# Altium schematic sheet Battery_BMS.SchDoc: Battery & BMS
size A3; DocumentNumber: 2; SheetNumber: 2; SheetTotal: 19
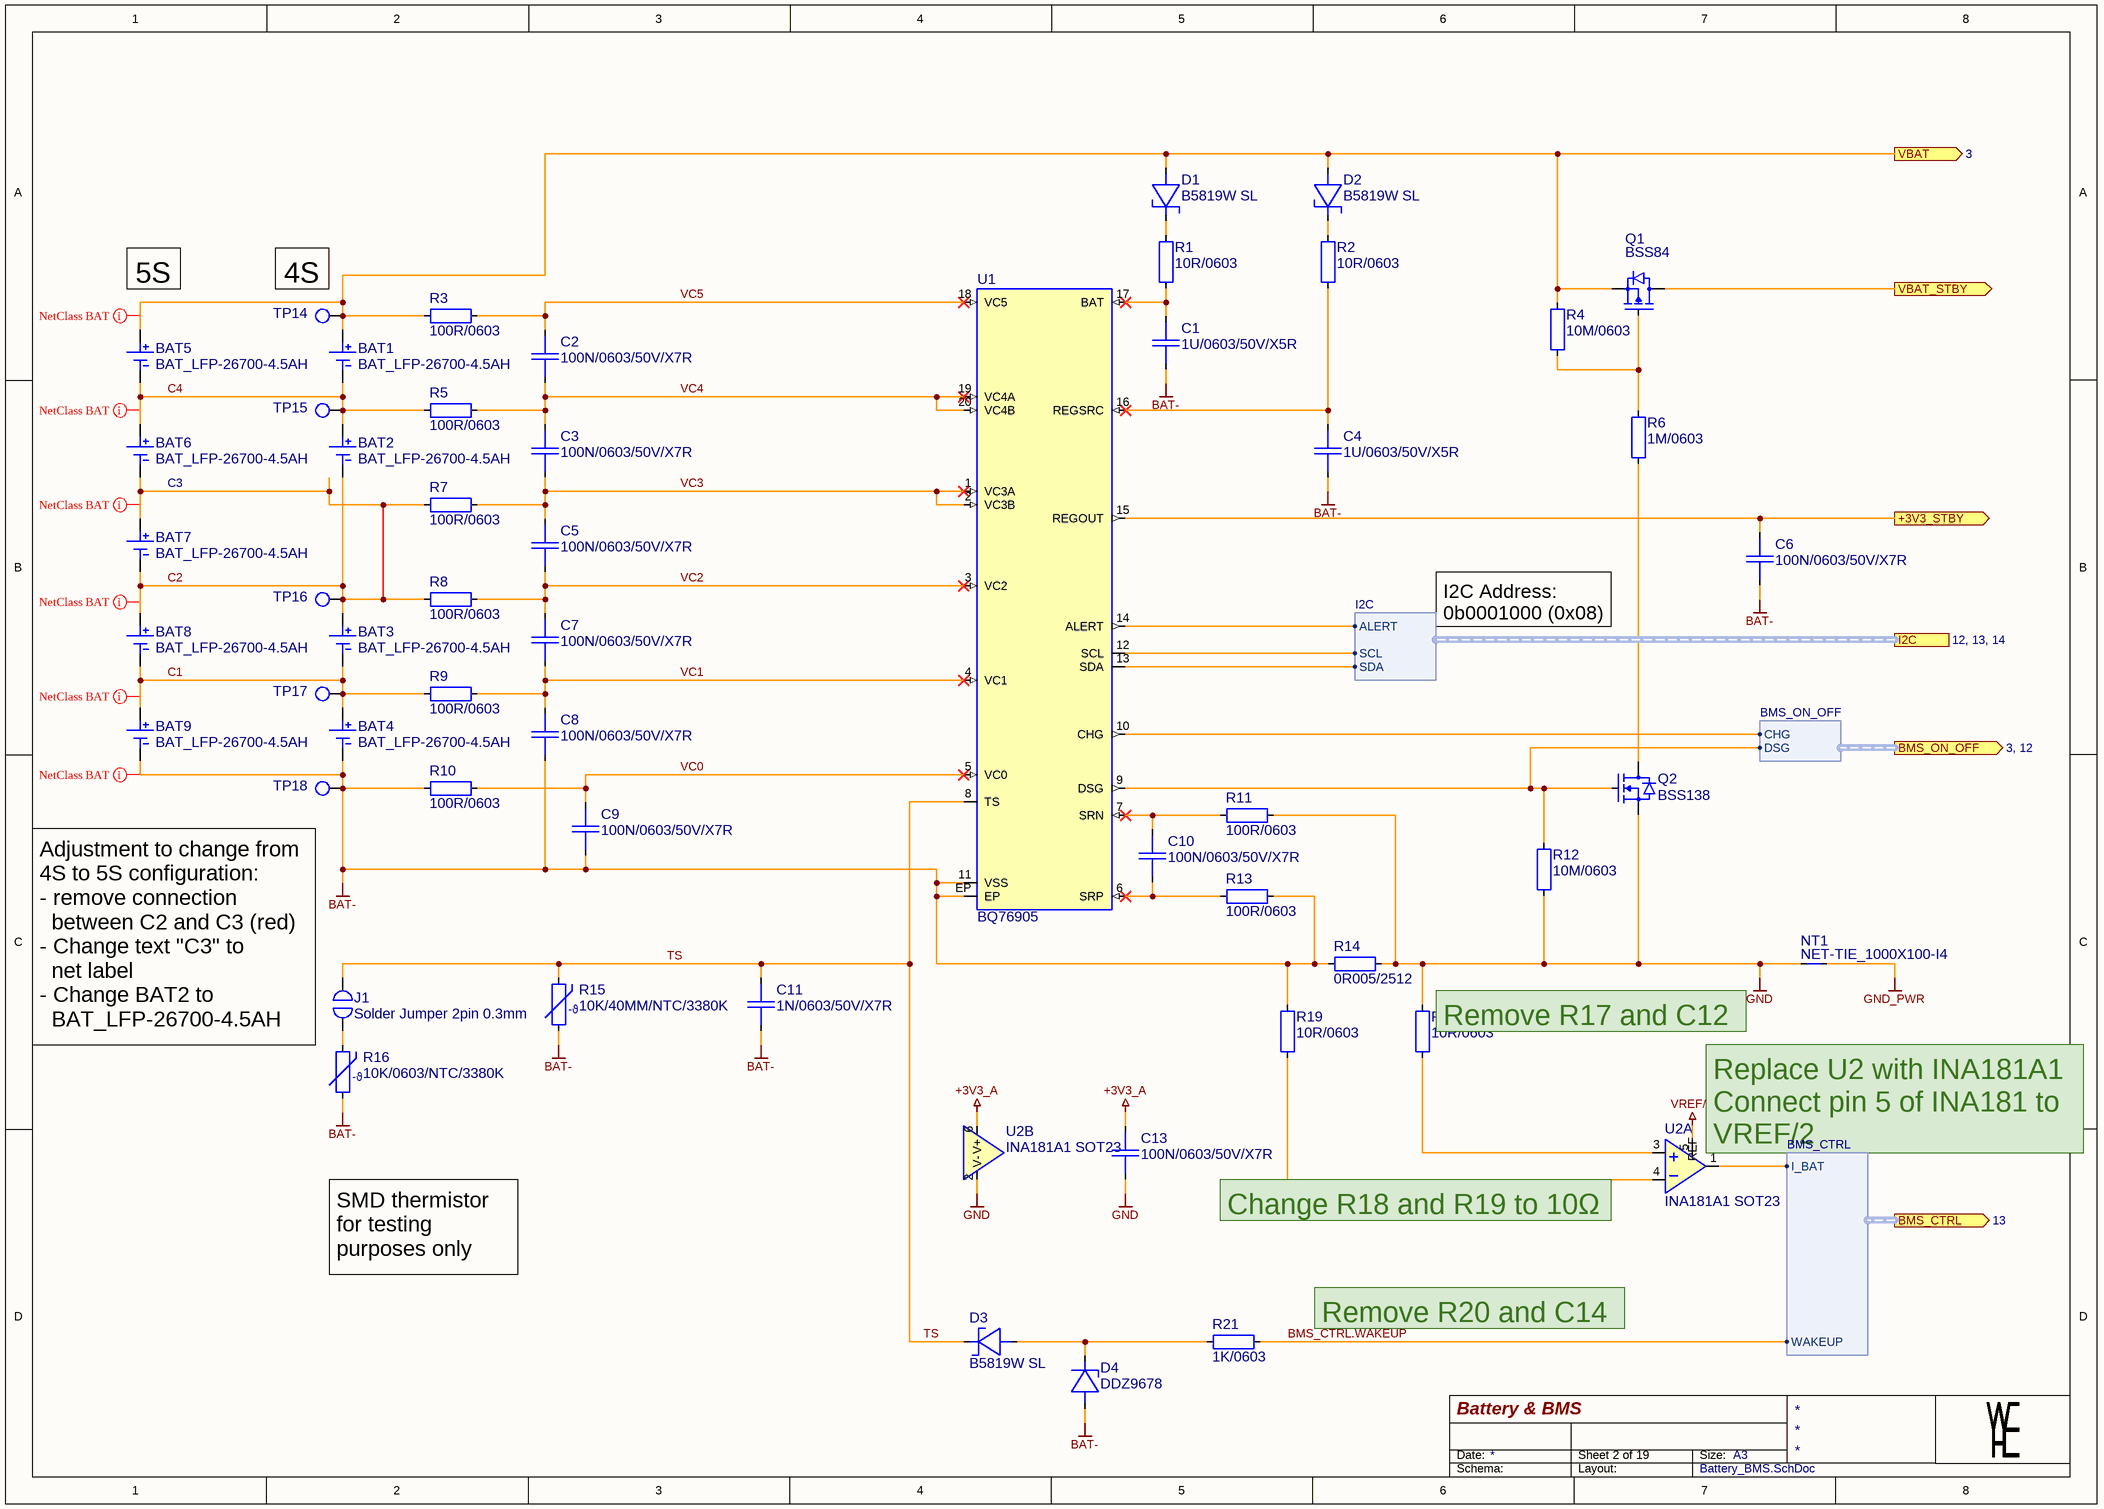
[diagram p0: Battery_BMS.SchDoc]

## Parts
BAT1  BAT_LFP-26700-4.5AH  [BAT-26700-PS]
BAT2  BAT_LFP-26700-4.5AH  [BAT-26700-PS]
BAT3  BAT_LFP-26700-4.5AH  [BAT-26700-PS]
BAT4  BAT_LFP-26700-4.5AH  [BAT-26700-PS]
BAT5  BAT_LFP-26700-4.5AH  [BAT-26700-PS]  (graphical)
BAT6  BAT_LFP-26700-4.5AH  [BAT-26700-PS]  (graphical)
BAT7  BAT_LFP-26700-4.5AH  [BAT-26700-PS]  (graphical)
BAT8  BAT_LFP-26700-4.5AH  [BAT-26700-PS]  (graphical)
BAT9  BAT_LFP-26700-4.5AH  [BAT-26700-PS]  (graphical)
C1  1U/0603/50V/X5R  [CAP0603_X7R]
C2  100N/0603/50V/X7R  [CAP0603_X7R]
C3  100N/0603/50V/X7R  [CAP0603_X7R]
C4  1U/0603/50V/X5R  [CAP0603_X7R]
C5  100N/0603/50V/X7R  [CAP0603_X7R]
C6  100N/0603/50V/X7R  [CAP0603_X7R]
C7  100N/0603/50V/X7R  [CAP0603_X7R]
C8  100N/0603/50V/X7R  [CAP0603_X7R]
C9  100N/0603/50V/X7R  [CAP0603_X7R]
C10  100N/0603/50V/X7R  [CAP0603_X7R]
C11  1N/0603/50V/X7R  [CAP0603_X7R]
C13  100N/0603/50V/X7R  [CAP0603_X7R]
D1  B5819W SL  [SOD3718X125]
D2  B5819W SL  [SOD3718X125]
D3  B5819W SL  [SOD3718X125]
D4  DDZ9678  [SOD3718X125]
J1  Solder Jumper 2pin 0.3mm  [Solder_Jumper_2pin_0.3mm]
NT1  NET-TIE_1000X100-I4  [NET-TIE_1000X100]  (net tie, no BOM)
Q1  BSS84  [SOT2395P280X125-3-SE]
Q2  BSS138  [SOT2395P280X125-3-SE]
R1  10R/0603  [R0603-0.40-WW]
R2  10R/0603  [R0603-0.40-WW]
R3  100R/0603  [R0603-0.40-WW]
R4  10M/0603  [R0603-0.40-WW]
R5  100R/0603  [R0603-0.40-WW]
R6  1M/0603  [R0603-0.40-WW]
R7  100R/0603  [R0603-0.40-WW]
R8  100R/0603  [R0603-0.40-WW]
R9  100R/0603  [R0603-0.40-WW]
R10  100R/0603  [R0603-0.40-WW]
R11  100R/0603  [R0603-0.40-WW]
R12  10M/0603  [R0603-0.40-WW]
R13  100R/0603  [R0603-0.40-WW]
R14  0R005/2512  [R2512-0.65-WW]
R15  10K/40MM/NTC/3380K  [RESD200W25D200H4000]
R16  10K/0603/NTC/3380K  [R0603-0.40-WW]
R18  10R/0603  [R0603-0.40-WW]
R19  10R/0603  [R0603-0.40-WW]
R21  1K/0603  [R0603-0.40-WW]
TP14  TP_THD_1.5/0.8  [TP_THD_1.5/0.8]  (value not drawn)  (no BOM)
TP15  TP_THD_1.5/0.8  [TP_THD_1.5/0.8]  (value not drawn)  (no BOM)
TP16  TP_THD_1.5/0.8  [TP_THD_1.5/0.8]  (value not drawn)  (no BOM)
TP17  TP_THD_1.5/0.8  [TP_THD_1.5/0.8]  (value not drawn)  (no BOM)
TP18  TP_THD_1.5/0.8  [TP_THD_1.5/0.8]  (value not drawn)  (no BOM)
U1  BQ76905  [QFN050P350X350X100-20-EP200X200]
U2  INA181A1 SOT23  [SOT2395P280X125-6-SE]  (parts A,B of 2)

## Ports
+3V3_STBY (out), BMS_CTRL (out, harness BMS_CTRL, see 13), BMS_ON_OFF (out, harness BMS_ON_OFF, see 3, 12), I2C (harness I2C, see 12, 13, 14), VBAT (out, see 3), VBAT_STBY (out)

## Harnesses
I2C: ALERT, SCL, SDA
BMS_ON_OFF: CHG, DSG
BMS_CTRL: I_BAT, WAKEUP

## Nets
+3V3_A: C13.1 U2.6(V+)
BAT-: BAT4.2(-) BAT9.2(-) C1.2 C4.2 C6.2 C8.2 C9.2 C11.2 D4.2(A) R10.1 R13.2 R14.1 R15.2 R16.2 R19.1 TP18.1 U1.11(VSS) U1.EP
GND: C13.2 NT1.1 Q2.2(SOURCE) R11.2 R12.2 R14.2 R18.1 U2.2(V-)
GND_PWR: NT1.2
VREF/2: U2.5(REF)
+3V3_STBY: C6.1 U1.15(REGOUT) ; port +3V3_STBY
BMS_CTRL.WAKEUP: R21.2 ; port BMS_CTRL.WAKEUP
C1: BAT3.2(-) BAT4.1(+) BAT8.2(-) BAT9.1(+) R9.1 TP17.1
C2: BAT2.2(-) BAT3.1(+) BAT6.2(-) BAT7.1(+) BAT7.2(-) BAT8.1(+) R7.1 R8.1 TP16.1
C4: BAT1.2(-) BAT2.1(+) BAT5.2(-) BAT6.1(+) R5.1 TP15.1
TS: C11.1 D3.1(C) J1.1 R15.1 U1.8(TS)
VBAT: BAT1.1(+) BAT5.1(+) D1.2(A) D2.2(A) Q1.2(SOURCE) R3.1 R4.1 TP14.1 ; port VBAT
VBAT_STBY: Q1.3(DRAIN) ; port VBAT_STBY
VC0: C9.1 R10.2 U1.5(VC0)
VC1: C7.2 C8.1 R9.2 U1.4(VC1)
VC2: C5.2 C7.1 R8.2 U1.3(VC2)
VC3: C3.2 C5.1 R7.2 U1.1(VC3A) U1.2(VC3B)
VC4: C2.2 C3.1 R5.2 U1.19(VC4A) U1.20(VC4B)
VC5: C2.1 R3.2 U1.18(VC5)
NetC1_1: C1.1 R1.2 U1.17(BAT)
NetC4_1: C4.1 R2.2 U1.16(REGSRC)
NetC10_1: C10.1 R11.1 U1.7(SRN)
NetC10_2: C10.2 R13.1 U1.6(SRP)
NetD1_1: D1.1(C) R1.1
NetD2_1: D2.1(C) R2.1
NetD3_2: D3.2(A) D4.1(C) R21.1
NetJ1_2: J1.2 R16.1
NetQ1_1: Q1.1(GATE) R4.2 R6.1
NetQ2_1: Q2.1(GATE) R12.1 U1.9(DSG) ; port BMS_ON_OFF.DSG
NetQ2_3: Q2.3(DRAIN) R6.2
NetR18_2: R18.2 U2.3(IN+)
NetR19_2: R19.2 U2.4(IN-)
NetU1_10: U1.10(CHG) ; port BMS_ON_OFF.CHG
NetU1_12: U1.12(SCL) ; port I2C.SCL
NetU1_13: U1.13(SDA) ; port I2C.SDA
NetU1_14: U1.14(ALERT) ; port I2C.ALERT
NetU2_1: U2.1(OUT) ; port BMS_CTRL.I_BAT

## Layout directives
net class BAT: BAT-, C1, C2, C4, VBAT

## Notes on the sheet
- 5S
- (near TP14) 4S
- C3
- I2C Address:
  0b0001000 (0x08)
- Adjustment to change from 4S to 5S configuration:
  - remove connection
  between C2 and C3 (red)
  - Change text "C3" to
  net label
  - Change BAT2 to
  BAT_LFP-26700-4.5AH
- (near R18) Remove R17 and C12
- (near U2) Replace U2 with INA181A1
  Connect pin 5 of INA181 to VREF/2
- Change R18 and R19 to 10Ω
- SMD thermistor for testing purposes only
- Remove R20 and C14
- Date:
- Size:
- A3
- Schema:
- Layout:
- (in symbol 10K/40MM/NTC/3380K) -ϑ
- (in symbol 10K/0603/NTC/3380K) -ϑ

## Library data of the parts
BAT1-BAT9 = BAT_LFP-26700-4.5AH: Battery LiFePO4 26700 4.5Ah; Manufacturer: Tenpower; Manufacturer Part Number 1: IFR26700-45HE; Part Number: BAT_LFP-26700-4.5AH; HelpURL: https://www.tenpowercell.com/wp-content/uploads/2023/08/TP-IFR26700-45HE-Product-Datasheet-v1.4.pdf; Manufacturer 1: Tenpower; Supplier 1: NKON; Supplier Part Number 1: 6097321571573
C1 C4 = 1U/0603/50V/X5R: CAP SM 0603 1.0uF 50V X5R; Manufacturer: GENERIC; Manufacturer 1: Samsung Electro-Mechanics; Manufacturer Part Number 1: CL10A105KB8NNNC; Absolute Value: 1E-6; Eurocircuits GPN: GPC0603105-X5R; Part Number: 1U/0603/50V/X5R; Package: 0603; Value: 1.0uF; HelpURL: https://mm.digikey.com/Volume0/opasdata/d220001/medias/docus/658/CL10A105KB8NNNC_Spec.pdf; Supplier 1: Digi-Key; Supplier Part Number 1: 1276-1860-1-ND; Manufacturer Part Number 3: CL10A105KB8NNNC; Supplier 3: LCSC; Supplier Part Number 3: C15849; JLC Type: Basic
C2 C3 C5-C10 C13 = 100N/0603/50V/X7R: CAP SM 0603 100nF 50V X7R; Manufacturer: GENERIC; Manufacturer 1: YAGEO; Manufacturer Part Number 1: CC0603KPX7R9BB104; Absolute Value: 1E-7; Eurocircuits GPN: GPC0603104; Part Number: 100N/0603/50V/X7R; Package: 0603; Value: 100nF; HelpURL: https://www.yageo.com/upload/media/product/app/datasheet/mlcc/upy-gphc_x7r_6_3v-to-250v.pdf; Supplier 1: Digi-Key; Supplier Part Number 1: 311-3567-1-ND; Supplier 3: LCSC; Supplier Part Number 3: C14663; Manufacturer 2: YAGEO; Manufacturer Part Number 2: CC0603MRX7R9BB104; Supplier 2: Digi-Key; Supplier Part Number 2: 311-4110-1-ND; JLC Type: Basic; Manufacturer Part Number 3: CC0603KRX7R9BB104
C11 = 1N/0603/50V/X7R: CAP SM 0603 1.0nF 50V X7R; Manufacturer: GENERIC; Manufacturer 1: YAGEO; Manufacturer Part Number 1: CC0603KPX7R9BB102; Absolute Value: 1E-9; Eurocircuits GPN: GPC0603102; Part Number: 1N/0603/50V/X7R; Package: 0603; Value: 1.0nF; HelpURL: https://www.yageo.com/upload/media/product/app/datasheet/mlcc/upy-gphc_x7r_6_3v-to-250v.pdf; Supplier 1: Digi-Key; Supplier Part Number 1: 13-CC0603KPX7R9BB102CT-ND; Manufacturer 2: YAGEO; Manufacturer Part Number 2: CC0603KRX7R9BB102; Supplier 2: Digi-Key; Supplier Part Number 2: 311-1080-1-ND; Manufacturer Part Number 3: CL10B102KB8NNNC; Supplier 3: LCSC; Supplier Part Number 3: C1588; JLC Type: Basic
D1-D3 = B5819W SL: 40V 600mV@1A 1A SOD-123 Schottky Barrier Diodes; Manufacturer: GENERIC; Manufacturer 1: SMC Diode Solutions; Part Number: B5819W SL; Package: SOD-123; Value: B5819W SL; Absolute Value: 40V; HelpURL: https://datasheet.lcsc.com/lcsc/2304140030_Jiangsu-Changjing-Electronics-Technology-Co---Ltd--B5819W-SL_C8598.pdf; Manufacturer 3: Jiangsu Changjing Electronics Technology Co., Ltd.; Manufacturer Part Number 3: B5819W SL; Supplier 3: LCSC; Supplier Part Number 3: C8598; JLC Type: Basic; Manufacturer Part Number 1: B5819WSL; Supplier 1: Digikey; Supplier Part Number 1: 1655-B5819WSLCT-ND
D4 = DDZ9678: Low current zener diode 1.8V 500mW SOD123; Manufacturer: Diodes Incorporated; Manufacturer Part Number 1: DDZ9678-7; Part Number: DDZ9678; Package: SOD-123; Value: 1.8V; Absolute Value: 1.8V; HelpURL: https://www.diodes.com/datasheet/download/DDZ96xx-DDZ97xx.pdf; Manufacturer 1: Diodes Incorporated; Supplier 1: Digikey; Supplier Part Number 1: DDZ9678DICT-ND; Manufacturer 3: DIODES; Manufacturer Part Number 3: DDZ9678-7; Supplier 3: LCSC; Supplier Part Number 3: C150464; JLC Type: Extended
J1 = Solder_Jumper_2pin_0.3mm: Solder jumper with two pins with a spacing of 0.3mm; Manufacturer: NONE; Part Number: Solder_Jumper_2pin_0.3mm
NT1 = NET-TIE_1000X100-I4: Net-Tie 10.00mmx1.00mm Inner Layer 4; Manufacturer: NONE; Part Number: NET-TIE_1000X100-I4; Width: 10.00m; Length: 1.00mm; Layer: Inner Layer 4
Q1 = BSS84: 50V P-Channel MOSFET; Manufacturer: GENERIC; Manufacturer 1: Good-Ark Semiconductor; Part Number: BSS84; Package: SOT23; HelpURL: https://goodarksemi.com/docs/datasheets/mosfets/BSS84.pdf; Manufacturer 3: Jiangsu Changjing Electronics Technology Co., Ltd.; Manufacturer Part Number 3: BSS84; Supplier 3: LCSC; Supplier Part Number 3: C114481; Manufacturer Part Number 1: BSS84; Supplier 1: Digi-Key; Supplier Part Number 1: 4786-BSS84CT-ND; Manufacturer 2: LRC; Manufacturer Part Number 2: LBSS84LT1G; Supplier 2: LCSC; Supplier Part Number 2: C8492; JLC Type: Extended
Q2 = BSS138: N-Kanal 50 V 220mA (Ta) 350mW (Ta) Oberflächenmontage SOT-23; Manufacturer: GENERIC; Manufacturer 1: ANBON SEMICONDUCTOR (INT'L) LIMITED; Part Number: BSS138; Package: SOT23; HelpURL: https://mm.digikey.com/Volume0/opasdata/d220001/medias/docus/3037/BSS138.pdf; Manufacturer Part Number 1: BSS138; Supplier 1: Digi-Key; Supplier Part Number 1: 4530-BSS138CT-ND; Manufacturer 3: FOSAN; Manufacturer Part Number 3: BSS138; Supplier 3: LCSC; Supplier Part Number 3: C2926186; JLC Type: Extended; Manufacturer 2: FOSAN; Manufacturer Part Number 2: BSS138; Supplier 2: LCSC; Supplier Part Number 2: C2926186
R1 R2 R18 R19 = 10R/0603: RES SM 0603 10R; Manufacturer: GENERIC; Manufacturer 1: YAGEO; Manufacturer Part Number 1: RC0603FR-1310RL; Absolute Value: 10; Eurocircuits GPN: GPR060310R; Part Number: 10R/0603; Package: 0603; Value: 10R; HelpURL: https://www.yageogroup.com/content/datasheet/asset/file/PYU-RC_GROUP_51_ROHS_L; Supplier 1: Digi-Key; Supplier Part Number 1: 13-RC0603FR-1310RLCT-ND; Manufacturer 2: YAGEO; Manufacturer Part Number 2: RC0603FR-1010RL; Supplier 2: Digi-Key; Supplier Part Number 2: 13-RC0603FR-1010RLCT-ND; JLC Type: Basic; Manufacturer 3: UNI-ROYAL; Manufacturer Part Number 3: 0603WAF100JT5E; Supplier 3: LCSC; Supplier Part Number 3: C22859
R3 R5 R7-R11 R13 = 100R/0603: RES SM 0603 100R; Manufacturer: GENERIC; Manufacturer 1: YAGEO; Manufacturer Part Number 1: RC0603FR-13100RL; Absolute Value: 100; Eurocircuits GPN: GPR0603100R; Part Number: 100R/0603; Package: 0603; Value: 100R; HelpURL: https://www.yageogroup.com/content/datasheet/asset/file/PYU-RC_GROUP_51_ROHS_L; Supplier 1: Digi-Key; Supplier Part Number 1: 13-RC0603FR-13100RLCT-ND; Manufacturer 2: YAGEO; Manufacturer Part Number 2: RC0603FR-10100RL; Supplier 2: Digi-Key; Supplier Part Number 2: 13-RC0603FR-10100RLCT-ND; Manufacturer 3: UNI-ROYAL(Uniroyal Elec); Manufacturer Part Number 3: 0603WAF1000T5E; Supplier 3: LCSC; Supplier Part Number 3: C22775
R4 R12 = 10M/0603: RES SM 0603 10M; Manufacturer: GENERIC; Manufacturer 1: YAGEO; Manufacturer Part Number 1: RC0603FR-1310ML; Absolute Value: 10000000; Eurocircuits GPN: GPR060310M; Part Number: 10M/0603; Package: 0603; Value: 10M; HelpURL: https://www.yageogroup.com/content/datasheet/asset/file/PYU-RC_GROUP_51_ROHS_L; Supplier 1: Digi-Key; Supplier Part Number 1: 13-RC0603FR-1310MLCT-ND; Manufacturer 2: YAGEO; Manufacturer Part Number 2: RC0603FR-1010ML; Supplier 2: Digi-Key; Supplier Part Number 2: 13-RC0603FR-1010MLCT-ND; Manufacturer 3: UNI-ROYAL(Uniroyal Elec); Manufacturer Part Number 3: 0603WAF1005T5E; Supplier 3: LCSC; Supplier Part Number 3: C7250; JLC Type: Basic
R6 = 1M/0603: RES SM 0603 1M; Manufacturer: GENERIC; Manufacturer 1: YAGEO; Manufacturer Part Number 1: RC0603FR-131ML; Absolute Value: 1000000; Eurocircuits GPN: GPR06031M; Part Number: 1M/0603; Package: 0603; Value: 1M; HelpURL: https://www.yageogroup.com/content/datasheet/asset/file/PYU-RC_GROUP_51_ROHS_L; Supplier 1: Digi-Key; Supplier Part Number 1: 13-RC0603FR-131MLCT-ND; JLC Type: Basic; Manufacturer 3: UNI-ROYAL(Uniroyal Elec); Manufacturer Part Number 3: 0603WAF1004T5E; Supplier 3: LCSC; Supplier Part Number 3: C22935; Manufacturer 2: YAGEO; Manufacturer Part Number 2: RC0603FR-101ML; Supplier 2: Digi-Key; Supplier Part Number 2: 13-RC0603FR-101MLCT-ND
R14 = 0R005/2512: RES SM 2512 0R005; Manufacturer: GENERIC; Manufacturer 1: Ohmite; Manufacturer Part Number 1: MCS3264R005FER; Absolute Value: 0.005; Part Number: 0R005/2512; Package: 2512; Value: 0R005; HelpURL: https://www.ohmite.com/assets/docs/res_mcs.pdf?r=false; Supplier 1: Digi-Key; Supplier Part Number 1: MCS3264R005FERCT-ND; Manufacturer 3: prosemi; Manufacturer Part Number 3: LMP25MF2P0R005; Supplier 3: LCSC; Supplier Part Number 3: C2937402
R15 = 10K/40MM/NTC/3380K: RES NTC THT 40mm 10K 3380K; Manufacturer: GENERIC; Manufacturer 1: Eaton - Electronics Division; Manufacturer Part Number 1: NRSE104F3380B1F; Absolute Value: 10000; Part Number: 10K/40MM/NTC/3380K; Value: 10K; HelpURL: https://eaton.com/content/dam/eaton/products/electronic-components/resources/data-sheet/eaton-nrse-epoxy-sealed-radial-lead-ntc-thermistor-data-sheet-elx1227.pdf; Supplier 1: Digi-Key; Supplier Part Number 1: 283-NRSE104F3380B1F-ND
R16 = 10K/0603/NTC/3380K: RES NTC SM 0603 10K; Manufacturer: GENERIC; Manufacturer 1: Murata; Manufacturer Part Number 1: NCU18XH103E60RB; Absolute Value: 10000; Eurocircuits GPN: GPR060310K; Part Number: 10K/0603/NTC/3380K; Package: 0603; Value: 10K; HelpURL: https://www.murata.com/en-us/api/pdfdownloadapi?cate=luNTCforTempeSenso&partno=NCU18XH103E60RB; Supplier 1: Digi-Key; Supplier Part Number 1: 490-18164-1-ND; Manufacturer 3: Sunlord; Manufacturer Part Number 3: SDNT1608X103F3380FTF; Supplier 3: LCSC; Supplier Part Number 3: C316397; JLC Type: Extended
R21 = 1K/0603: RES SM 0603 1K; Manufacturer: GENERIC; Manufacturer 1: YAGEO; Manufacturer Part Number 1: RC0603FR-131KL; Absolute Value: 1000; Eurocircuits GPN: GPR06031K; Part Number: 1K/0603; Package: 0603; Value: 1K; HelpURL: https://www.yageogroup.com/content/datasheet/asset/file/PYU-RC_GROUP_51_ROHS_L; Supplier 1: Digi-Key; Supplier Part Number 1: 13-RC0603FR-131KLCT-ND; Manufacturer 2: YAGEO; Manufacturer Part Number 2: RC0603FR-101KL; Supplier 2: Digi-Key; Supplier Part Number 2: 13-RC0603FR-101KLCT-ND; Manufacturer 3: UNI-ROYAL(Uniroyal Elec); Manufacturer Part Number 3: 0603WAF1001T5E; Supplier 3: LCSC; Supplier Part Number 3: C21190; JLC Type: Basic
TP14-TP18 = TP_THD_1.5/0.8: THT Test Point 1.5/0.8mm; Manufacturer: NONE; Part Number: TP_THD_1.5/0.8
U1 = BQ76905: BQ76905 2-Series to 5-Series High Accuracy Battery Monitor and Protector for Li-Ion, Li-Polymer, LiFePO4 (LFP), and LTO Battery Packs; Manufacturer: Texas Instruments; Manufacturer Part Number 1: BQ76905RGRR; Part Number: BQ76905; HelpURL: https://www.ti.com/lit/ds/symlink/bq76905.pdf; Manufacturer 1: Texas Instruments; Supplier 1: Digi-Key; Supplier Part Number 1: 296-BQ76905RGRRCT-ND; Manufacturer 3: Texas Instruments; Manufacturer Part Number 3: BQ76905RGRR; Supplier 3: LCSC; Supplier Part Number 3: C22394458
U2 = INA181A1 SOT23: INA181A1, Bidirectional, Low- and High-Side Voltage Output, Current-Sense Amplifier, 20 V/V, SOT23; Manufacturer: Texas Instruments; Manufacturer Part Number 1: INA181A1IDBVR; Part Number: INA181A1 SOT23; Package: SOT23-6; HelpURL: https://www.ti.com/lit/ds/symlink/ina181.pdf; Manufacturer 1: Texas Instruments; Supplier 1: Digi-Key; Supplier Part Number 1: 296-47656-1-ND; Manufacturer 3: Texas Instruments; Manufacturer Part Number 3: INA181A1IDBVR; Supplier 3: LCSC; Supplier Part Number 3: C2058943; Manufacturer 2: Texas Instruments; Manufacturer Part Number 2: INA181A1IDBVT; Supplier 2: Digi-Key; Supplier Part Number 2: 296-46634-1-ND; Manufacturer 4: Texas Instruments; Manufacturer Part Number 4: INA181A1IDBVT; Supplier 4: LCSC; Supplier Part Number 4: C2861997; JLC Type: Extended